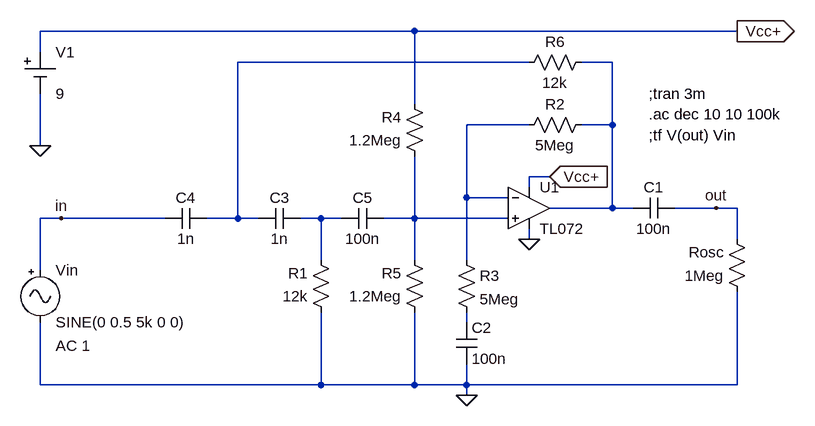
[diagram p0: schematic sallen-key-high-pass.asc]
sallen-key-high-pass.asc, the LTspice schematic file:
Version 4
SHEET 1 1284 680
WIRE -32 -128 -608 -128
WIRE 464 -128 -32 -128
WIRE -608 -96 -608 -128
WIRE 144 -80 -304 -80
WIRE 272 -80 224 -80
WIRE -32 -16 -32 -128
WIRE 144 16 48 16
WIRE 272 16 272 -80
WIRE 272 16 224 16
WIRE -608 48 -608 -32
WIRE 176 96 144 96
WIRE 144 112 144 96
WIRE 48 128 48 16
WIRE 112 128 48 128
WIRE 272 144 272 16
WIRE 272 144 176 144
WIRE 304 144 272 144
WIRE 432 144 368 144
WIRE 464 144 432 144
WIRE -576 160 -608 160
WIRE -416 160 -576 160
WIRE -304 160 -304 -80
WIRE -304 160 -352 160
WIRE -272 160 -304 160
WIRE -176 160 -208 160
WIRE -144 160 -176 160
WIRE -32 160 -32 64
WIRE -32 160 -80 160
WIRE 112 160 -32 160
WIRE 144 192 144 176
WIRE 464 192 464 144
WIRE -176 224 -176 160
WIRE -32 224 -32 160
WIRE 48 224 48 128
WIRE -608 240 -608 160
WIRE 48 320 48 304
WIRE -608 416 -608 320
WIRE -176 416 -176 304
WIRE -176 416 -608 416
WIRE -32 416 -32 304
WIRE -32 416 -176 416
WIRE 48 416 48 384
WIRE 48 416 -32 416
WIRE 464 416 464 272
WIRE 464 416 48 416
WIRE 48 432 48 416
FLAG -608 48 0
FLAG 464 -128 Vcc+
IOPIN 464 -128 Out
FLAG -576 160 in
FLAG 144 192 0
FLAG 48 432 0
FLAG 176 96 Vcc+
IOPIN 176 96 In
FLAG 432 144 out
SYMBOL TL072 144 80 R0
SYMATTR InstName U1
SYMBOL res 240 0 R90
WINDOW 0 0 56 VBottom 2
WINDOW 3 32 56 VTop 2
SYMATTR InstName R2
SYMATTR Value 5Meg
SYMBOL signal -608 224 R0
WINDOW 123 24 132 Left 2
WINDOW 39 24 160 Left 2
SYMATTR Value2 AC 1
SYMATTR InstName Vin
SYMATTR Value SINE(0 0.5 5k 0 0)
SYMBOL cell -608 -96 R0
WINDOW 123 0 0 Left 2
WINDOW 39 0 0 Left 2
SYMATTR InstName V1
SYMATTR Value 9
SYMBOL cap 368 128 R90
WINDOW 0 0 32 VBottom 2
WINDOW 3 32 32 VTop 2
SYMATTR InstName C1
SYMATTR Value 100n
SYMBOL res 32 208 R0
SYMATTR InstName R3
SYMATTR Value 5Meg
SYMBOL cap 32 384 M180
WINDOW 0 24 56 Left 2
WINDOW 3 24 8 Left 2
SYMATTR InstName C2
SYMATTR Value 100n
SYMBOL cap -144 176 R270
WINDOW 0 32 32 VTop 2
WINDOW 3 0 32 VBottom 2
SYMATTR InstName C5
SYMATTR Value 100n
SYMBOL res -16 80 R180
WINDOW 0 36 76 Left 2
WINDOW 3 36 40 Left 2
SYMATTR InstName R4
SYMATTR Value 1.2Meg
SYMBOL res -16 320 R180
WINDOW 0 36 76 Left 2
WINDOW 3 36 40 Left 2
SYMATTR InstName R5
SYMATTR Value 1.2Meg
SYMBOL res 480 288 R180
WINDOW 0 36 76 Left 2
WINDOW 3 36 40 Left 2
SYMATTR InstName Rosc
SYMATTR Value 1Meg
SYMBOL cap -272 176 R270
WINDOW 0 32 32 VTop 2
WINDOW 3 0 32 VBottom 2
SYMATTR InstName C3
SYMATTR Value 1n
SYMBOL cap -416 176 R270
WINDOW 0 32 32 VTop 2
WINDOW 3 0 32 VBottom 2
SYMATTR InstName C4
SYMATTR Value 1n
SYMBOL res -160 320 R180
WINDOW 0 36 76 Left 2
WINDOW 3 36 40 Left 2
SYMATTR InstName R1
SYMATTR Value 12k
SYMBOL res 240 -96 R90
WINDOW 0 0 56 VBottom 2
WINDOW 3 32 56 VTop 2
SYMATTR InstName R6
SYMATTR Value 12k
TEXT 328 -32 Left 2 !;tran 3m
TEXT 328 0 Left 2 !.ac dec 10 10 100k
TEXT 328 32 Left 2 !;tf V(out) Vin

The netlist it stands for:
* sallen-key-high-pass.asc
* U1: TL072 (symbol TL072 not available, pins judged from their places): In+=N005 In-=N003 V+=Vcc+ V-=0 OUT=N002
R2 N002 N003 5Meg
Vin in 0 SINE(0 0.5 5k 0 0) AC 1
V1 Vcc+ 0 9
C1 out N002 100n
R3 N003 N006 5Meg
C2 0 N006 100n
C5 N004 N005 100n
R4 N005 Vcc+ 1.2Meg
R5 0 N005 1.2Meg
Rosc 0 out 1Meg
C3 N001 N004 1n
C4 in N001 1n
R1 0 N004 12k
R6 N002 N001 12k
;tran 3m
.ac dec 10 10 100k
;tf V(out) Vin
.backanno
.end